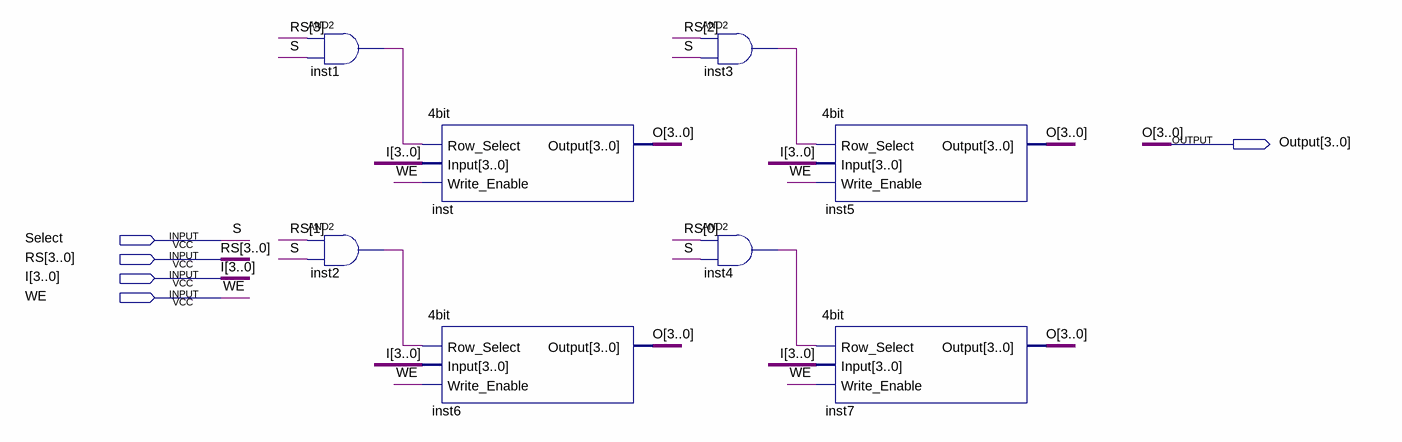
[diagram p0: schematic sheet]
// Quartus schematic word.bdf as structural Verilog: 8 symbols, 5 pins
module word (
  input  Select,
  input  [3:0] RS,
  input  [3:0] I,
  input  WE,
  output [3:0] Output
);

  wire inst1_out, inst2_out, inst3_out, inst4_out;

  and inst1 (inst1_out, RS[3], Select);
  and inst2 (inst2_out, RS[1], Select);
  \4bit  inst (.Row_Select(inst1_out), .Input(I), .Write_Enable(WE), .Output(Output));
  \4bit  inst6 (.Row_Select(inst2_out), .Input(I), .Write_Enable(WE), .Output(Output));
  and inst3 (inst3_out, RS[2], Select);
  and inst4 (inst4_out, RS[0], Select);
  \4bit  inst5 (.Row_Select(inst3_out), .Input(I), .Write_Enable(WE), .Output(Output));
  \4bit  inst7 (.Row_Select(inst4_out), .Input(I), .Write_Enable(WE), .Output(Output));

  // Other names for the same wires on the sheet: O[3:0] = Output; S = Select
endmodule
